# EAGLE design debugino (EAGLE 9.6.1)

## Sheet 1 of 2
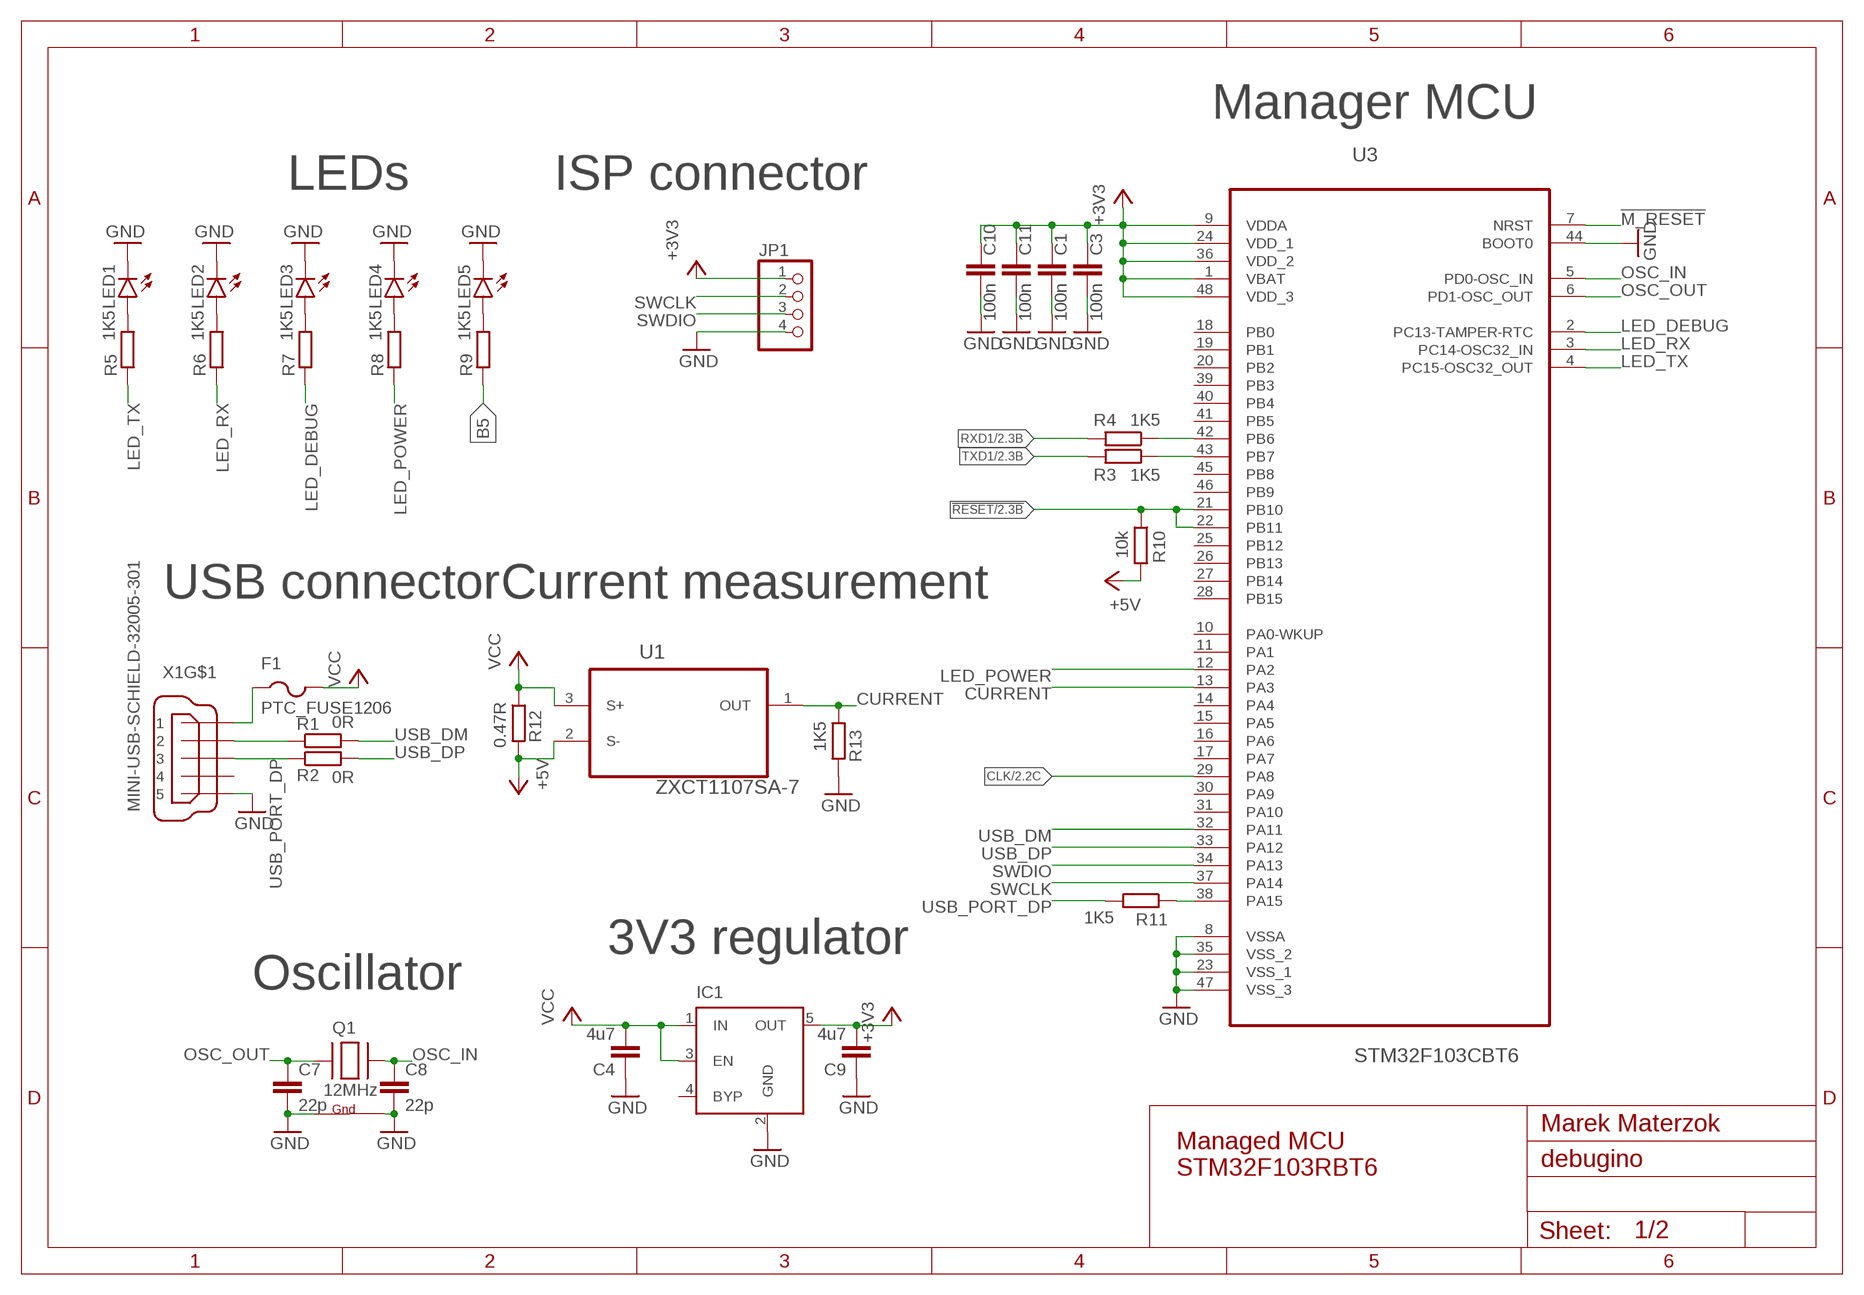
[diagram p0: schematic, sheet 1]

### Parts
C1  100n  CAPACITOR0402  [CAPC1008X70M]
C3  100n  CAPACITOR0402  [CAPC1008X70M]
C4  4u7  CAPACITOR0603  [CAPC1608X100M]
C7  22p  CAPACITOR0402  [CAPC1008X70M]
C8  22p  CAPACITOR0402  [CAPC1008X70M]
C9  4u7  CAPACITOR0603  [CAPC1608X100M]
C10  100n  CAPACITOR0402  [CAPC1008X70M]
C11  100n  CAPACITOR0402  [CAPC1008X70M]
F1  PTC_FUSE1206  [FUSC3216X100M]
IC1  MIC5219XX  [SOT23-5]
JP1  PINHD-1X4  [1X04]
LED1  LEDCHIP-LED0603  [CHIP-LED0603]
LED2  LEDCHIP-LED0603  [CHIP-LED0603]
LED3  LEDCHIP-LED0603  [CHIP-LED0603]
LED4  LEDCHIP-LED0603  [CHIP-LED0603]
LED5  LEDCHIP-LED0603  [CHIP-LED0603]
Q1  12MHz  XTAL-4-3225  [NX3225]
R1  0R  RESISTOR0603  [RESC1608X55M]
R2  0R  RESISTOR0603  [RESC1608X55M]
R3  1K5  RESISTOR0603  [RESC1608X55M]
R4  1K5  RESISTOR0603  [RESC1608X55M]
R5  1K5  RESISTOR0603  [RESC1608X55M]
R6  1K5  RESISTOR0603  [RESC1608X55M]
R7  1K5  RESISTOR0603  [RESC1608X55M]
R8  1K5  RESISTOR0603  [RESC1608X55M]
R9  1K5  RESISTOR0603  [RESC1608X55M]
R10  10k  RESISTOR0603  [RESC1608X55M]
R11  1K5  RESISTOR0603  [RESC1608X55M]
R12  0.47R  RESISTOR0805  [RESC2012X65M]
R13  1K5  RESISTOR0603  [RESC1608X55M]
U1  ZXCT1107SA-7  [SOT91P240X110-3N]
U3  STM32F103CBT6  [QFP50P900X900X160-48N]
X1  MINI-USB-SCHIELD-32005-301  [32005-301]

### Nets
!M_RESET: U3.7(NRST)
!RESET: R10.1 U3.21(PB10) U3.22(PB11) ; also sheet 2
+3V3: C1.1 C3.1 C9.2 C10.1 C11.1 IC1.5(OUT) JP1.1 U3.1(VBAT) U3.9(VDDA) U3.24(VDD_1) U3.36(VDD_2) U3.48(VDD_3)
+5V: R10.2 R12.2 U1.2(S-) ; also sheet 2
B5: R9.1 ; also sheet 2
CLK: U3.29(PA8) ; also sheet 2
CURRENT: R13.1 U1.1(OUT) U3.13(PA3)
GND: C1.2 C3.2 C4.1 C7.2 C8.2 C9.1 C10.2 C11.2 IC1.2(GND) JP1.4 LED1.C LED2.C LED3.C LED4.C LED5.C Q1.2(G2) Q1.4(G1) R13.2 U3.8(VSSA) U3.23(VSS_1) U3.35(VSS_2) U3.44(BOOT0) U3.47(VSS_3) X1.5 ; also sheet 2
LED_DEBUG: R7.1 U3.2(PC13-TAMPER-RTC)
LED_POWER: R8.1 U3.12(PA2)
LED_RX: R6.1 U3.3(PC14-OSC32_IN)
LED_TX: R5.1 U3.4(PC15-OSC32_OUT)
N$1: LED1.A R5.2
N$2: LED2.A R6.2
N$5: F1.1 X1.1
N$6: LED3.A R7.2
N$7: LED4.A R8.2
N$8: LED5.A R9.2
OSC_IN: C8.1 Q1.3(X2) U3.5(PD0-OSC_IN)
OSC_OUT: C7.1 Q1.1(X1) U3.6(PD1-OSC_OUT)
RXD1: R4.2 ; also sheet 2
SWCLK: JP1.2 U3.37(PA14)
SWDIO: JP1.3 U3.34(PA13)
TXD1: R3.2 ; also sheet 2
UART1_RX: R3.1 U3.43(PB7)
UART1_TX: R4.1 U3.42(PB6)
USB_DM: R1.2 U3.32(PA11)
USB_DP: R2.2 U3.33(PA12)
USB_PORT_DM: R1.1 X1.2
USB_PORT_DP: R2.1 R11.2 X1.3
USB_PULLUP: R11.1 U3.38(PA15)
VCC: C4.2 F1.2 IC1.1(IN) IC1.3(EN) R12.1 U1.3(S+)
Unconnected: IC1.4(BYP) U3.10(PA0-WKUP) U3.11(PA1) U3.14(PA4) U3.15(PA5) U3.16(PA6) U3.17(PA7) U3.18(PB0) U3.19(PB1) U3.20(PB2) U3.25(PB12) U3.26(PB13) U3.27(PB14) U3.28(PB15) U3.30(PA9) U3.31(PA10) U3.39(PB3) U3.40(PB4) U3.41(PB5) U3.45(PB8) U3.46(PB9) X1.4 X1.M1(S:S1) X1.M2(S:S2) X1.M3(S:S3) X1.M4(S:S4)

### Notes on the sheet
- Manager MCU
- LEDs | ISP connector
- USB connector | Current measurement
- 3V3 regulator
- Oscillator
- Managed MCU
  STM32F103RBT6
- Marek Materzok

## Sheet 2 of 2: Connections for target MCU
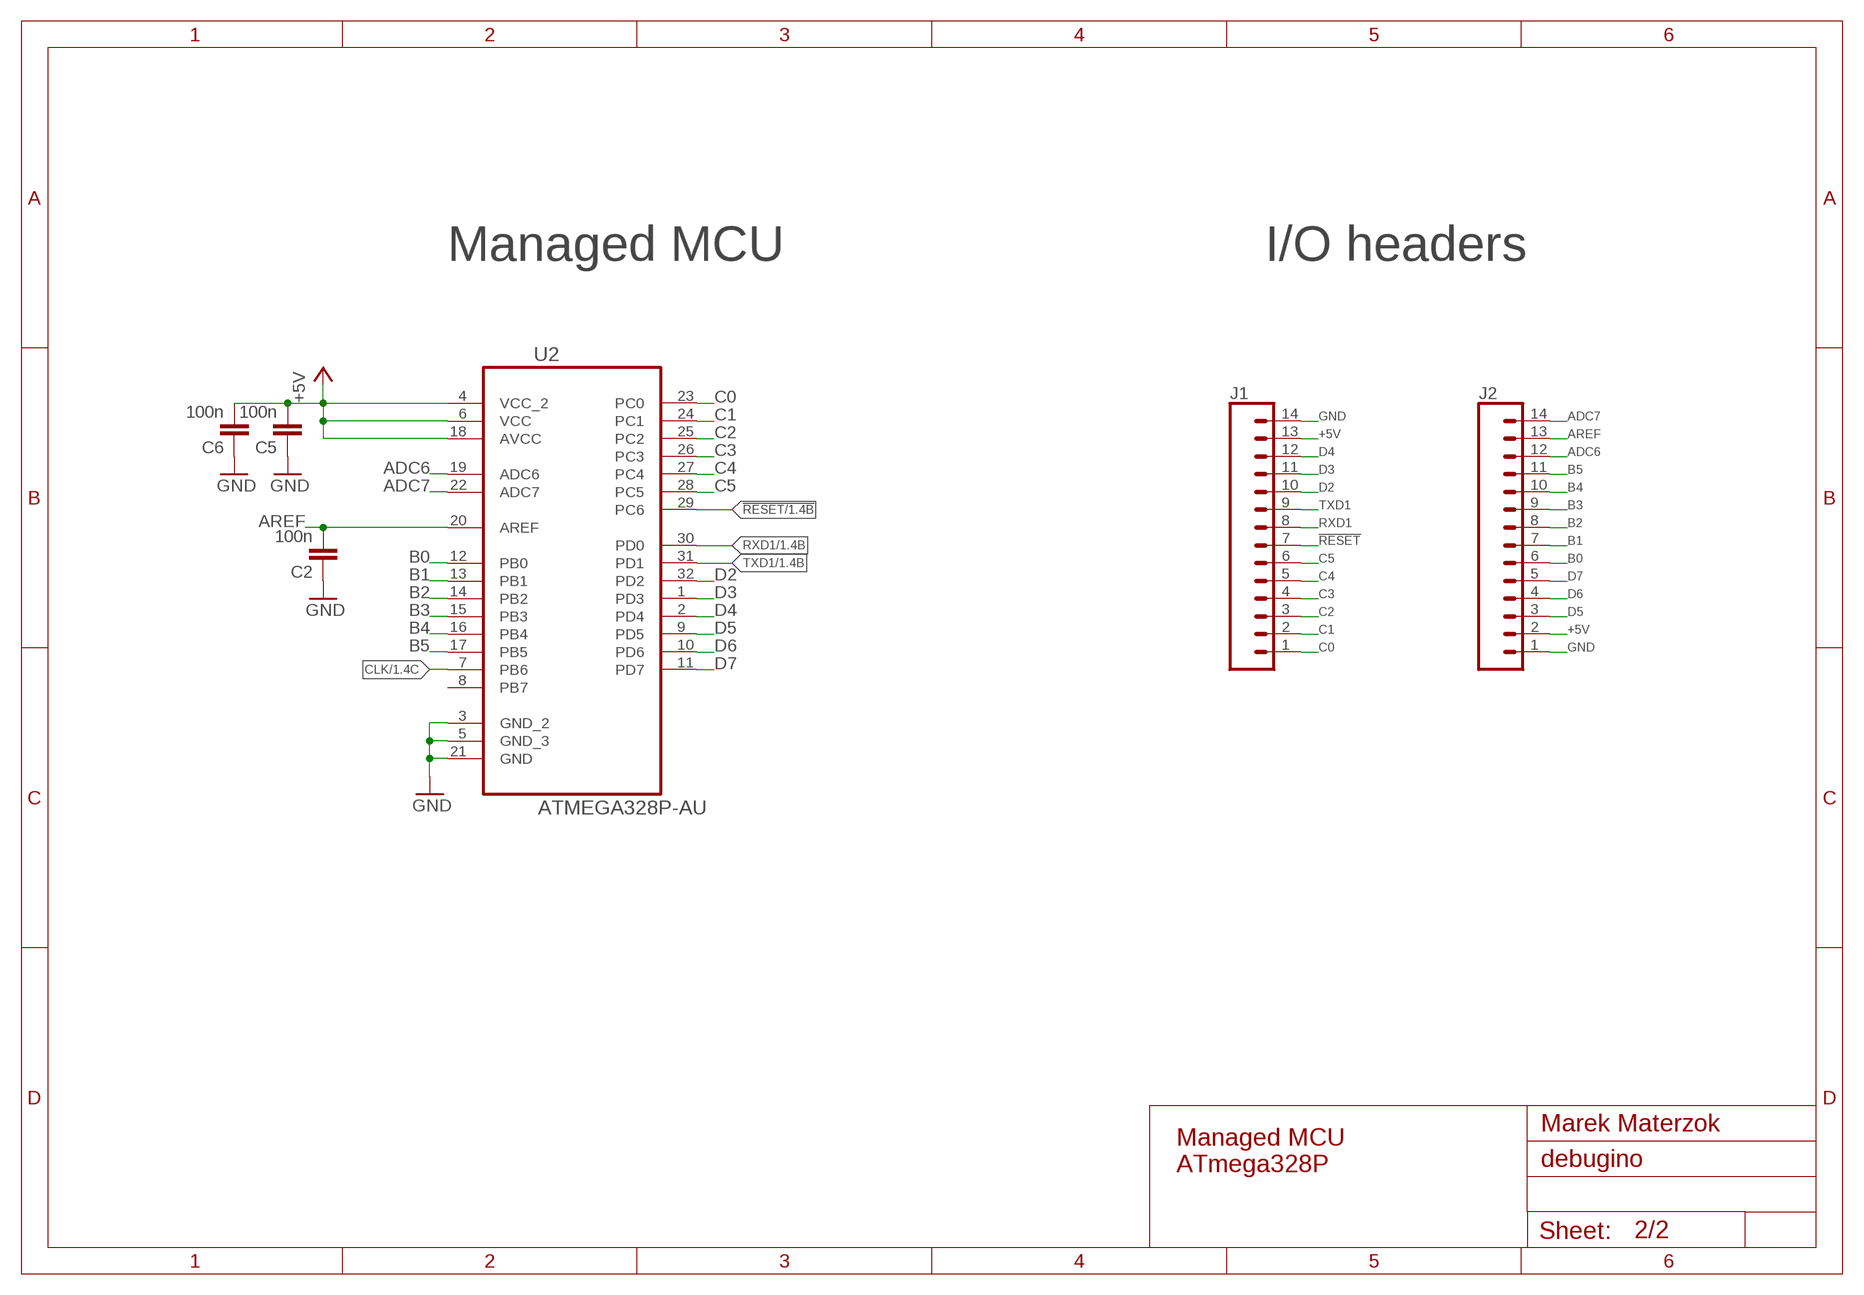
[diagram p1: schematic, sheet 2]

### Parts
C2  100n  CAPACITOR0402  [CAPC1008X70M]
C5  100n  CAPACITOR0402  [CAPC1008X70M]
C6  100n  CAPACITOR0402  [CAPC1008X70M]
J1  CONN_14  [1X14]
J2  CONN_14  [1X14]
U2  ATMEGA328P-AU  [QFP80P900X900X120-32N]

### Nets
!RESET: J1.7 U2.29(PC6) ; also sheet 1
+5V: C5.2 C6.2 J1.13 J2.2 U2.4(VCC_2) U2.6(VCC) U2.18(AVCC) ; also sheet 1
ADC6: J2.12 U2.19(ADC6)
ADC7: J2.14 U2.22(ADC7)
AREF: C2.2 J2.13 U2.20(AREF)
B0: J2.6 U2.12(PB0)
B1: J2.7 U2.13(PB1)
B2: J2.8 U2.14(PB2)
B3: J2.9 U2.15(PB3)
B4: J2.10 U2.16(PB4)
B5: J2.11 U2.17(PB5) ; also sheet 1
C0: J1.1 U2.23(PC0)
C1: J1.2 U2.24(PC1)
C2: J1.3 U2.25(PC2)
C3: J1.4 U2.26(PC3)
C4: J1.5 U2.27(PC4)
C5: J1.6 U2.28(PC5)
CLK: U2.7(PB6) ; also sheet 1
D2: J1.10 U2.32(PD2)
D3: J1.11 U2.1(PD3)
D4: J1.12 U2.2(PD4)
D5: J2.3 U2.9(PD5)
D6: J2.4 U2.10(PD6)
D7: J2.5 U2.11(PD7)
GND: C2.1 C5.1 C6.1 J1.14 J2.1 U2.3(GND_2) U2.5(GND_3) U2.21(GND) ; also sheet 1
RXD1: J1.8 U2.30(PD0) ; also sheet 1
TXD1: J1.9 U2.31(PD1) ; also sheet 1
Unconnected: U2.8(PB7)

### Notes on the sheet
- Managed MCU | I/O headers
- Managed MCU
  ATmega328P
- Marek Materzok

## Library data of the parts
C1-C11 = custom:CAPACITOR
F1 = custom:PTC_FUSE
IC1 = v-reg-micrel:MIC5219XX: VOLTAGE REGULATOR; OC_FARNELL: unknown; OC_NEWARK: unknown
J1 J2 = SparkFun-Connectors:CONN_14: Multi connection point. Often used as Generic Header-pin footprint for 0.1 inch spaced/style header connections On any of the 0.1 inch spaced packages, you can populate with these: Break Away Headers - Straight <https://www.sparkfun.com/products/116> (PRT-00116) Break Away Male Headers - Right Angle <https://www.sparkfun.com/products/553> (PRT-00553) Female Headers <https://www.sparkfun.com/products/115> (PRT-00115) Break Away Headers - Machine Pin <https://www.sparkfun.com/products/117> (PRT-00117) Break Away Female Headers - Swiss Machine Pin <https://www.sparkfun.com/products/743> (PRT-00743) For SCREWTERMINALS and SPRING TERMINALS visit here: Screw Terimnals on SparkFun.com <https://www.sparkfun.com/search/results?term=Screw+Terminals> (5mm/3.5mm/2.54mm spacing) This device is also useful as a general connection point to wire up your design to another part of your project. Our various solder wires solder well into these plated through hole pads. Hook-Up Wire - Assortment (Stranded, 22 AWG) <https://www.sparkfun.com/products/11375> (PRT-11375) Hook-Up Wire - Assortment (Solid Core, 22 AWG) <https://www.sparkfun.com/products/11367> (PRT-11367) View the entire wire category on our website here <https://www.sparkfun.com/categories/141> Special notes: Molex polarized connector foot print use with SKU : PRT-08231 with associated crimp pins and housings. 1MM SMD Version SKU: PRT-10208 NOTES ON THE VARIANTS LOCK and LOCK_LONGPADS... This footprint was designed to help hold the alignment of a through-hole component (i.e. 6-pin header) while soldering it into place. You may notice that each hole has been shifted either up or down by 0.005 of an inch from it's more standard position (which is a perfectly straight line). This slight alteration caused the pins (the squares in the middle) to touch the edges of the holes. Because they are alternating, it causes a "brace" to hold the component in place. 0.005 has proven to be the perfect amount of "off-center" position when using our standard breakaway headers. Although looks a little odd when you look at the bare footprint, once you have a header in there, the alteration is very hard to notice. Also,if you push a header all the way into place, it is covered up entirely on the bottom side.
JP1 = pinhead:PINHD-1X4: PIN HEADER
LED1-LED5 = led:LED: LED OSRAM: - CHIPLED LG R971, LG N971, LY N971, LG Q971, LY Q971, LO R971, LY R971 LH N974, LH R974 LS Q976, LO Q976, LY Q976 LO Q996 - Hyper CHIPLED LW Q18S LB Q993, LB Q99A, LB R99A - SideLED LS A670, LO A670, LY A670, LG A670, LP A670 LB A673, LV A673, LT A673, LW A673 LH A674 LY A675 LS A676, LA A676, LO A676, LY A676, LW A676 LS A679, LY A679, LG A679 - Hyper Micro SIDELED® LS Y876, LA Y876, LO Y876, LY Y876 LT Y87S - SmartLED LW L88C, LW L88S LB L89C, LB L89S, LG L890 LS L89K, LO L89K, LY L89K LS L896, LA L896, LO L896, LY L896 - TOPLED LS T670, LO T670, LY T670, LG T670, LP T670 LSG T670, LSP T670, LSY T670, LOP T670, LYG T670 LG T671, LOG T671, LSG T671 LB T673, LV T673, LT T673, LW T673 LH T674 LS T676, LA T676, LO T676, LY T676, LB T676, LH T676, LSB T676, LW T676 LB T67C, LV T67C, LT T67C, LS T67K, LO T67K, LY T67K, LW E67C LS E67B, LA E67B, LO E67B, LY E67B, LB E67C, LV E67C, LT E67C LW T67C LS T679, LY T679, LG T679 LS T770, LO T770, LY T770, LG T770, LP T770 LB T773, LV T773, LT T773, LW T773 LH T774 LS E675, LA E675, LY E675, LS T675 LS T776, LA T776, LO T776, LY T776, LB T776 LHGB T686 LT T68C, LB T68C - Hyper Mini TOPLED® LB M676 - Mini TOPLED Santana® LG M470 LS M47K, LO M47K, LY M47K Source: http://www.osram.convergy.de LUXEON: - LUMILED® LXK2-PW12-R00, LXK2-PW12-S00, LXK2-PW14-U00, LXK2-PW14-V00 LXK2-PM12-R00, LXK2-PM12-S00, LXK2-PM14-U00 LXK2-PE12-Q00, LXK2-PE12-R00, LXK2-PE12-S00, LXK2-PE14-T00, LXK2-PE14-U00 LXK2-PB12-K00, LXK2-PB12-L00, LXK2-PB12-M00, LXK2-PB14-N00, LXK2-PB14-P00, LXK2-PB14-Q00 LXK2-PR12-L00, LXK2-PR12-M00, LXK2-PR14-Q00, LXK2-PR14-R00 LXK2-PD12-Q00, LXK2-PD12-R00, LXK2-PD12-S00 LXK2-PH12-R00, LXK2-PH12-S00 LXK2-PL12-P00, LXK2-PL12-Q00, LXK2-PL12-R00 Source: www.luxeon.com KINGBRIGHT: KA-3528ASYC Source: www.kingbright.com
Q1 = adafruit:XTAL-4: Classic 4-pin 3.2 x 2.5mm crystal
R1-R13 = custom:RESISTOR
U1 = Diodes_Inc_By_element14_Batch_1:ZXCT1107SA-7: LOW POWER HIGH-SIDE CURRENT MONITORS; MPN: ZXCT1107SA-7; OC_FARNELL: 1904027; OC_NEWARK: 55T4047; PACKAGE: SOT-23-3; SUPPLIER: DIODES INC.
U2 = Atmel_By_element14_Batch_1:ATMEGA328P-AU: 8-bit Microcontroller with In-System Programmable Flash; MPN: ATMEGA328P-AU; OC_FARNELL: 1715486; OC_NEWARK: 14R4631; PACKAGE: TQFP-32; SUPPLIER: Atmel
U3 = ST Microelctronics_By_element14_Batch_1:STM32F103CBT6: Medium-density performance line ARM-based 32-bit MCU; MPN: STM32F103CBT6; OC_FARNELL: 1606327; OC_NEWARK: 11N8296; PACKAGE: QFP-48; SUPPLIER: STMICROELECTRONICS
X1 = con-cypressindustries:MINI-USB-SCHIELD-: MINI USB-B Conector Source: www.cypressindustries.com; OC_FARNELL: unknown; OC_NEWARK: unknown

## Board
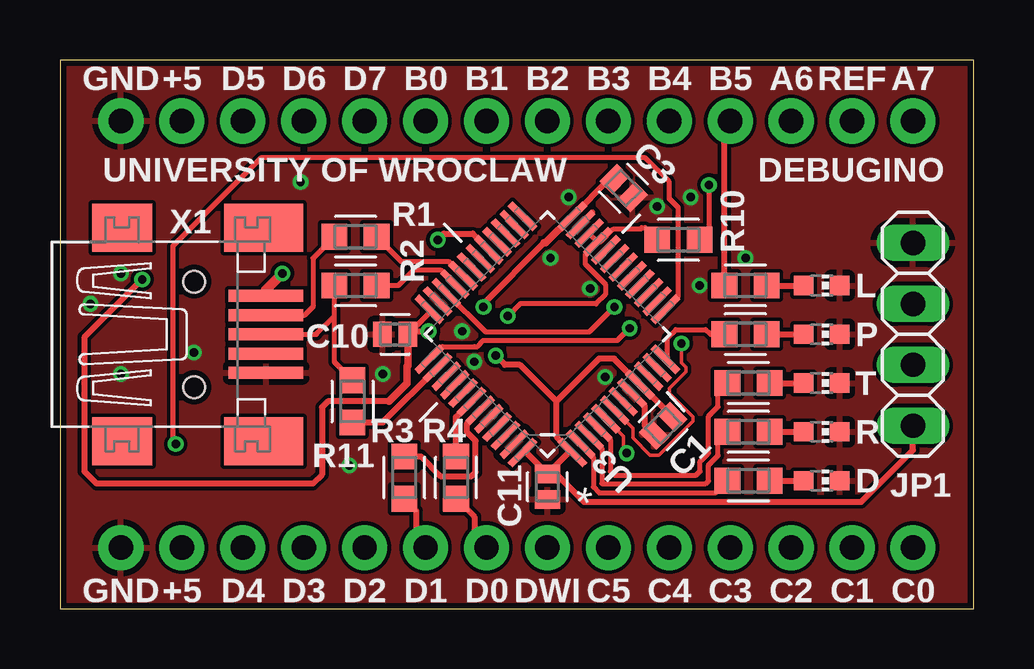
[diagram p2: board, top side]
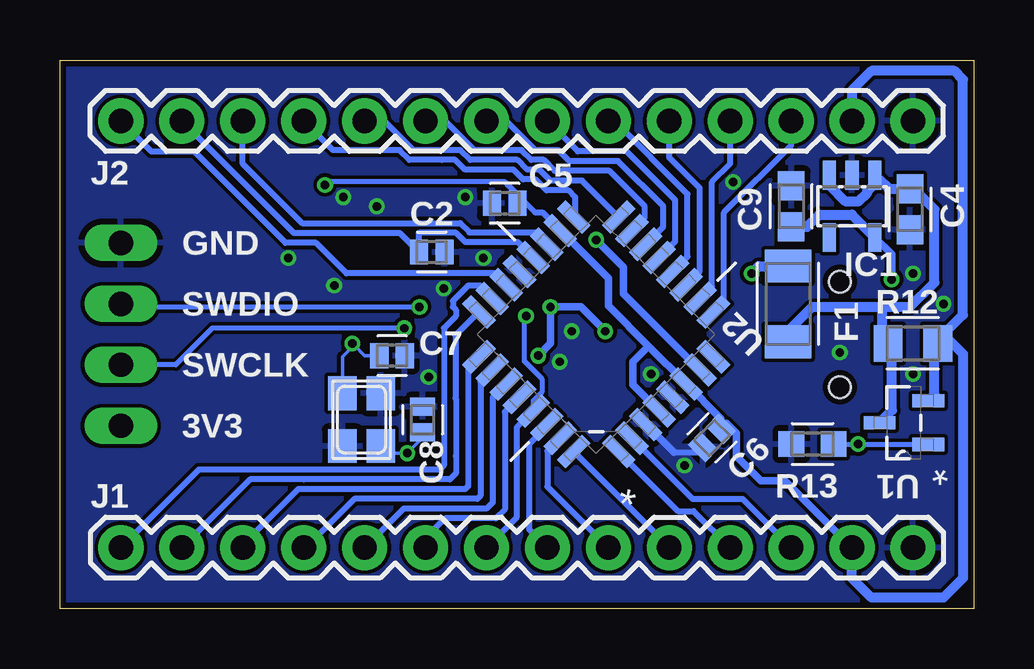
[diagram p3: board, bottom side, seen from below]

Size 38.1 x 22.86 mm. Coordinates in mm from the lower left corner, seen from the top.
Outline: 0,22.86 0,0 38.1,0 38.1,22.86 0,22.86
Copper layers (1*16): Top 0.035mm / dielectric 1.5mm / Bottom 0.035mm
Design rules "SeeedStudio_2layer_DRU_no_angle_20140221": minimum track width 6mil, minimum drill 12mil, track to track 6mil, track to pad 6mil, pad to pad 6mil, via to via 6mil, smd to smd 0mil, copper to edge 10mil, drill to drill 10mil, minimum pad ring 10mil, minimum via ring 6mil, stop-mask expansion 2mil, vias tented up to drill 100mil, thermal gap 10mil

### Footprints (pad centres in the part's own frame; a part is rotated, then mirrored left to right if it is on the bottom)
CAPC1008X70M = smd 0.753 x 1.029: 1 -0.531,0; 2 0.531,0
CAPC1608X100M = smd 1.209 x 1.115: 1 -0.853,0; 2 0.853,0
FUSC3216X100M = smd 1.365 x 1.92: 1 -1.575,0; 2 1.575,0
SOT23-5 = smd 0.55 x 1.2: 1 -0.95,-1.3; 2 0,-1.3; 3 0.95,-1.3; 4 0.95,1.3; 5 -0.95,1.3
1X14 = drill 1.016 pad 1.88: 1 0,0; 2 2.54,0; 3 5.08,0; 4 7.62,0; 5 10.16,0; 6 12.7,0; 7 15.24,0; 8 17.78,0; 9 20.32,0; 10 22.86,0; 11 25.4,0; 12 27.94,0; 13 30.48,0; 14 33.02,0
1X04 = drill 1.016 long: 1 -3.81,0; 2 -1.27,0; 3 1.27,0; 4 3.81,0
CHIP-LED0603 = smd 0.8 x 0.8: A 0,-0.75; C 0,0.75
NX3225 = smd 1.4 x 1.2: 1 -1.1,-0.8; 2 1.1,-0.8; 3 1.1,0.8; 4 -1.1,0.8
RESC1608X55M = smd 1.07 x 1.074: 1 -0.88,0; 2 0.88,0
RESC2012X65M = smd 1.2 x 1.52: 1 -1.035,0; 2 1.035,0
SOT91P240X110-3N = smd 1.321 x 0.559: 1 -1.016,0.914; 2 -1.016,-0.914; 3 1.016,0
QFP80P900X900X120-32N = smd 1.473 x 0.508: 1 -4.115,2.794; 2 -4.115,2.007; 3 -4.115,1.194; 4 -4.115,0.406; 5 -4.115,-0.406; 6 -4.115,-1.194; 7 -4.115,-2.007; 8 -4.115,-2.794; 17 4.115,-2.794; 18 4.115,-2.007; 19 4.115,-1.194; 20 4.115,-0.406; 21 4.115,0.406; 22 4.115,1.194; 23 4.115,2.007; 24 4.115,2.794 | smd 0.508 x 1.473: 9 -2.794,-4.115; 10 -2.007,-4.115; 11 -1.194,-4.115; 12 -0.406,-4.115; 13 0.406,-4.115; 14 1.194,-4.115; 15 2.007,-4.115; 16 2.794,-4.115; 25 2.794,4.115; 26 2.007,4.115; 27 1.194,4.115; 28 0.406,4.115; 29 -0.406,4.115; 30 -1.194,4.115; 31 -2.007,4.115; 32 -2.794,4.115
QFP50P900X900X160-48N = smd 1.473 x 0.279: 1 -4.216,2.743; 2 -4.216,2.261; 3 -4.216,1.753; 4 -4.216,1.245; 5 -4.216,0.762; 6 -4.216,0.254; 7 -4.216,-0.254; 8 -4.216,-0.762; 9 -4.216,-1.245; 10 -4.216,-1.753; 11 -4.216,-2.261; 12 -4.216,-2.743; 25 4.216,-2.743; 26 4.216,-2.261; 27 4.216,-1.753; 28 4.216,-1.245; 29 4.216,-0.762; 30 4.216,-0.254; 31 4.216,0.254; 32 4.216,0.762; 33 4.216,1.245; 34 4.216,1.753; 35 4.216,2.261; 36 4.216,2.743 | smd 0.279 x 1.473: 13 -2.743,-4.216; 14 -2.261,-4.216; 15 -1.753,-4.216; 16 -1.245,-4.216; 17 -0.762,-4.216; 18 -0.254,-4.216; 19 0.254,-4.216; 20 0.762,-4.216; 21 1.245,-4.216; 22 1.753,-4.216; 23 2.261,-4.216; 24 2.743,-4.216; 37 2.743,4.216; 38 2.261,4.216; 39 1.753,4.216; 40 1.245,4.216; 41 0.762,4.216; 42 0.254,4.216; 43 -0.254,4.216; 44 -0.762,4.216; 45 -1.245,4.216; 46 -1.753,4.216; 47 -2.261,4.216; 48 -2.743,4.216
32005-301 = smd 3.1 x 0.5: 1 3,1.6; 2 3,0.8; 3 3,0; 4 3,-0.8; 5 3,-1.6 | smd 2.5 x 2: M1 -3,-4.45; M2 -3,4.45 | smd 3.3 x 2: M3 2.9,4.45; M4 2.9,-4.45 | hole 0.9: 0,2.2; 0,-2.2

### Placement (x,y rotation side)
C1  25.15,7.62 225 top
C2  22.61,14.86 180 bottom
C3  23.49,17.53 315 top
C4  2.67,16.64 90 bottom
C5  19.56,16.89 0 bottom
C6  10.92,7.11 45 bottom
C7  24.26,10.54 0 bottom
C8  22.99,7.87 90 bottom
C9  7.62,16.76 270 bottom
C10  13.97,11.43 180 top
C11  20.32,5.08 270 top
F1  7.75,12.7 270 bottom
IC1  5.08,16.76 180 bottom
J1  35.56,2.54 0 bottom
J2  2.54,20.32 180 bottom
JP1  35.56,11.43 90 top
LED1  31.75,9.4 270 top
LED2  31.75,7.37 270 top
LED3  31.75,5.33 270 top
LED4  31.75,11.43 270 top
LED5  31.75,13.46 270 top
Q1  25.53,7.87 270 bottom
R1  12.32,15.49 0 top
R2  12.32,13.46 0 top
R3  14.35,5.46 270 top
R4  16.51,5.46 270 top
R5  28.7,9.4 0 top
R6  28.7,7.37 0 top
R7  28.7,5.33 0 top
R8  28.57,11.43 0 top
R9  28.57,13.46 0 top
R10  25.78,15.37 0 top
R11  12.19,8.64 90 top
R12  2.54,11.05 0 bottom
R13  6.73,6.86 180 bottom
U1  2.92,7.75 180 bottom
U2  15.75,11.43 135 bottom
U3  20.32,11.43 135 top
X1  5.59,11.43 0 top

### Tracks (layer width: path | path; a pad name or v marks a point on that pad's centre or on a via)
!RESET  (via drill 0.35)
  Top 0.203: v18.67,12.19 19.18,12.7 22.35,12.7 22.73,13.08 22.73,13.52 21.89,14.37 21.89,14.76 U3.21 | U3.22 U3.21 | U3.21 22.55,15.29 23.08,15.82 24.21,15.82 24.26,15.88 24.39,15.88 R10.1
  Bottom 0.203: U2.29 18.37,8.66 17.99,9.04 17.99,9.55 18.74,10.3 18.74,12.12 v18.67,12.19
  Bottom 0.254: J1.7 19.05,3.81 19.05,7.55 U2.29
+3V3  (via drill 0.35)
  Top 0.203: 22.91,17.9 C3.1 | C10.1 15.4,12.33 U3.36 | U3.9
  Top 0.254: C11.1 19.42,6.51 U3.48 | C11.1 21.22,6.51 U3.1 20.7,7.17 20.7,8.64 | C11.1 20.68,5.61 21.84,4.45 33.4,4.45 35.56,6.6 JP1.1 | 20.7,8.64 22.48,10.41 23.1,10.41 U3.9 | U3.24 22.91,17.9 | v18.16,10.54 18.54,10.16 19.18,10.16 20.7,8.64 | C10.1 14.63,11.56 v15.37,11.56 | U3.9 C1.1 | 13.72,8.64 11.18,8.64 10.92,8.38 10.92,5.59 10.54,5.21 1.52,5.21 1.02,5.71 1.02,11.3 v3.43,13.72 | 20.18,15.24 17.65,12.71
  Top 0.305: C10.1 14.5,10.12 14.47,10.09 14.47,9.39 13.72,8.64 | U3.24 20.25,15.24 20.18,15.24 | 17.65,12.71 v17.65,12.57
  Bottom 0.305: v3.43,13.72 3.43,14.76 IC1.5 | v18.16,10.54 17.65,11.05 v17.65,12.57 16.38,12.57 v15.37,11.56
  Bottom 0.406: C9.2 6.96,15.91 6.45,16.42 5.09,16.42 IC1.5
+5V  (via drill 0.35)
  Top 0.203: v27.05,17.65 27.05,15.76 R10.2
  Bottom 0.203: 18.29,16.51 19.43,17.65 19.56,17.78 26.92,17.78 v27.05,17.65
  Bottom 0.254: 18.29,16.51 17.99,16.51 U2.18 | 19.43,17.65 19.03,17.25 C5.2
  Bottom 0.305: 13.57,10.94 U2.6 10.55,7.92 C6.2 10.32,7.71 9.91,7.3 9.91,6.35 8.89,5.33 7.87,5.33 J1.13 | 13.57,10.94 15.24,12.61 15.24,13.76 U2.18 | U2.4 14.22,9.33 14.22,10.29 13.57,10.94
  Bottom 0.406: R12.2 1.65,11.05 | 1.65,11.05 1.27,11.43 | 1.27,11.43 0.46,12.24 0.46,22.05 0.81,22.4 4.27,22.4 5.08,21.59 J2.2 | 1.27,11.43 0.46,10.62 0.46,1.27 1.27,0.46 4.27,0.46 5.08,1.27 J1.13 | 1.65,11.05 1.65,8.91 U1.2
ADC6
  Bottom 0.254: J2.12 30.48,18.54 28,16.06 21.41,16.06 21.04,15.68 18.31,15.68 U2.19
ADC7
  Bottom 0.254: U2.22 19.98,13.97 26.16,13.97 27.43,15.24 28.7,15.24 32.51,19.05 34.29,19.05 J2.14
AREF
  Bottom 0.254: U2.20 19.02,15.27 21.2,15.27 21.58,15.65 23.14,15.65 C2.2 23.93,15.65 28.35,15.65 J2.13
B0
  Bottom 0.254: U2.12 11.94,14.66 11.94,17.27 14.99,20.32 J2.6
B1
  Bottom 0.254: U2.13 12.45,15.31 12.45,17.02 14.48,19.05 16.51,19.05 J2.7
B2
  Bottom 0.254: U2.14 12.95,15.91 12.95,16.76 14.83,18.64 16.87,18.64 17.32,19.1 18.29,19.1 19.5,20.32 J2.8
B3
  Bottom 0.254: U2.15 13.72,16.3 13.72,16.76 15.19,18.24 17.48,18.24 17.93,18.69 18.45,18.69 18.86,19.1 20.82,19.1 22.04,20.32 J2.9
B4
  Bottom 0.254: U2.16 16.33,17.83 17.64,17.83 18.1,18.29 18.62,18.29 19.03,18.69 20.99,18.69 21.41,19.11 22.35,19.11 22.36,19.1 23.36,19.1 24.58,20.32 J2.10
B5
  Top 0.254: R9.1 27.7,20.07 J2.11
  Bottom 0.254: U2.17 16.62,16.38 16.62,17.14 16.9,17.42 17.81,17.42 18.27,17.88 18.79,17.88 19.2,18.29 21.21,18.29 21.62,18.7 22.18,18.7 22.19,18.69 23.53,18.69 23.94,19.1 26.72,19.1 J2.11
C0
  Bottom 0.254: U2.23 20.47,13.31 20.57,13.46 21.08,13.46 21.72,12.83 21.72,12.57 21.59,12.45 21.59,12.19 22.1,11.68 22.1,5.97 22.28,5.79 32.31,5.79 J1.1
C1
  Bottom 0.254: U2.24 21.61,11.38 21.61,8.77 21.59,8.75 21.59,6.35 21.59,5.64 21.84,5.38 27.94,5.38 30.18,5.38 J1.2
C2
  Bottom 0.254: U2.25 21.08,10.05 21.08,5.11 21.21,4.98 28.17,4.98 30.48,2.67 J1.3
C3
  Bottom 0.254: J1.4 27.86,2.54 25.82,4.57 20.7,4.57 20.57,4.7 20.57,9.44 U2.26
C4
  Bottom 0.254: U2.27 20.07,8.8 20.07,4.42 20.32,4.17 23.77,4.17 J1.5
C5
  Bottom 0.254: J1.6 22.86,2.95 22.05,3.76 19.94,3.76 19.56,4.14 19.56,8.2 U2.28
CLK  (via drill 0.35)
  Top 0.254: v15.75,15.37 16,15.62 17.21,15.62 U3.29
  Bottom 0.305: U2.7 14.61,13.12 14.61,14.22 v15.75,15.37
CURRENT  (via drill 0.35)
  Top 0.203: U3.13 25.77,13 25.77,16.7 25.4,17.08 25.4,17.78 24.38,18.8 8.39,18.8 4.7,15.1 4.7,6.99 v4.83,6.86
  Bottom 0.203: R13.1 v4.83,6.86 4.8,6.83 U1.1
D2
  Bottom 0.254: J1.10 12.7,2.56 U2.32
D3
  Bottom 0.254: U2.1 12.33,4.06 11.68,4.06 J1.11
D4
  Bottom 0.254: U2.2 11.73,4.57 9.65,4.57 J1.12
D5
  Bottom 0.254: U2.9 10.41,12.81 10.41,16.51 7.62,19.3 J2.3
D6
  Bottom 0.254: U2.10 10.92,13.42 10.92,17.78 10.16,18.54 J2.4
D7
  Bottom 0.254: U2.11 11.43,14.06 11.43,17.53 12.7,18.8 J2.5
GND  (via drill 0.35)
  Top 0.203: U3.23 22.22,16.52
  Top 0.254: C1.2 24.38,7.63 24.38,8.44 U3.8
  Bottom 0.254: 12.52,6.51 11.52,6.51 C6.1
  Bottom 0.305: U2.3 12.52,6.51
  other vias: 22.73,9.65 13.46,9.78 20.45,14.61 24.89,16.76 17.27,10.29 16.76,11.56 26.29,17.14 22.1,13.34 28.57,14.61 12.07,5.97 26.67,13.46 10.03,17.78 21.21,17.14 1.27,12.7 2.54,9.78 5.59,10.67 2.54,13.97
  pour Bottom: 0,0 0,22.86 38.1,22.86 38.1,0
  pour Top: 0,0 0,22.86 38.1,22.86 38.1,0
LED_DEBUG
  Top 0.203: U3.2 22.23,6.32 22.23,5.07 22.48,4.83 27.31,4.83 27.69,5.2
  Top 0.254: R7.1 27.69,5.2
LED_POWER
  Top 0.203: U3.12 25.33,10.47 25.33,11.29 25.67,11.63 26.92,11.63 27.12,11.43 R8.1
LED_RX
  Top 0.203: U3.3 22.59,6.68 22.59,5.22 22.6,5.21 26.92,5.21 27.03,5.32 27.03,5.98 27.43,6.38 27.43,6.99 R6.1
LED_TX
  Top 0.203: U3.4 22.95,7.04 22.95,5.71 23.1,5.56 26.52,5.56 26.68,5.72 26.68,6.12 27.03,6.48 27.03,8.01 27.43,8.41 27.43,9.01 R5.1
N$1
  Top 0.254: R5.2 LED1.A
N$2
  Top 0.254: R6.2 LED2.A
N$5  (via drill 0.35)
  Top 0.406: X1.1 8.59,13.29 v9.27,13.97
  Bottom 0.406: v9.27,13.97 8.97,14.28 F1.1
N$6
  Top 0.254: R7.2 LED3.A
N$7
  Top 0.254: R8.2 LED4.A
N$8
  Top 0.254: R9.2 LED5.A
OSC_IN  (via drill 0.35)
  Top 0.152: 22.51,8.16 23.49,7.18 23.49,6.6 v23.62,6.48
  Top 0.254: U3.5 22.51,8.16 | 22.51,8.16
  Bottom 0.152: Q1.3 24.43,6.48 v23.62,6.48 22.99,7.11 C8.1
OSC_OUT  (via drill 0.35)
  Top 0.152: v25.91,11.05 25.91,10.24 26.09,10.06 26.09,9.87 25.4,9.18 25.4,8.97 26.38,7.99 26.38,7.8 24.96,6.39 | U3.6 23.88,7.51 23.88,7.11 24.6,6.39 24.96,6.39 | 24.96,6.39
  Bottom 0.152: C7.1 25.4,10.54 25.84,10.99 | 25.84,10.99 v25.91,11.05 | Q1.1 26.33,10.5 25.84,10.99
RXD1
  Top 0.254: R4.2 17.27,3.82 17.27,3.05 J1.8
  Bottom 0.254: U2.30 17.81,7.59 18.54,6.86 18.54,3.3 J1.8
SWCLK  (via drill 0.35)
  Top 0.203: U3.37 15.93,10.92 17.27,10.92 17.4,10.92 17.65,11.18 23.24,11.18 v23.75,11.68
  Bottom 0.203: v23.75,11.68 31.75,11.68 33.27,10.16 JP1.2
SWDIO  (via drill 0.35)
  Top 0.203: U3.34 17.74,11.53 22.07,11.53 v23.11,12.57
  Bottom 0.203: v23.11,12.57 35.43,12.57 JP1.3
TXD1
  Top 0.203: R3.2 14.85,4.07
  Top 0.254: J1.9 14.85,2.93 14.85,4.07
  Bottom 0.254: U2.31 17.78,6.56 17.78,5.08 J1.9
UART1_RX
  Top 0.254: R3.1 15.04,6.34 15.86,5.53 17.16,5.53 17.33,5.69 17.33,6.99 16.98,7.34 16.98,7.73 U3.43
UART1_TX
  Top 0.254: R4.1 16.51,7.98 U3.42
USB_DM
  Top 0.203: U3.32 16.22,14.45 14.24,14.45 R1.2
USB_DP
  Top 0.203: U3.33 15.89,14.1 14.73,14.1 14.1,13.46 R2.2
USB_PORT_DM
  Top 0.203: X1.2 10.21,12.23 10.55,12.57 10.55,14.61 R1.1
USB_PORT_DP
  Top 0.203: X1.3 10.68,11.43 11.44,12.19 11.44,12.7 | 11.44,12.7 R2.1 | R11.2 11.44,10.27 11.44,12.7
USB_PULLUP
  Top 0.254: R11.1 13.45,7.76 U3.38
VCC
  Bottom 0.406: IC1.1 3.96,17.89 | 3.96,17.89 3.56,17.49 C4.2 2.5,17.49 1.65,16.64 1.65,13.59 2.67,12.57 3.81,12.57 | IC1.3 6.03,17.64 5.37,16.98 4.79,16.98 4.45,17.32 4.45,17.39 3.96,17.89 | 3.81,12.57 6.73,12.57 7.75,11.56 F1.2 | 3.81,12.57 3.81,11.44 R12.1 3.42,10.89 3.42,8.26 U1.3

### Text on the board
tNames: GND | +5 | D5 | D6 | D7 | B0 | B1 | B2 | B3 | B4 | B5 | A6 | REF | A7 | UNIVERSITY OF WROCLAW | DEBUGINO | L | P | T | R | D | GND | +5 | D4 | D3 | D2 | D1 | D0 | DWI | C5 | C4 | C3 | C2 | C1 | C0
bNames: GND | SWDIO | SWCLK | 3V3